# Altium schematic sheet 3_5V_Regulator.SchDoc
size A
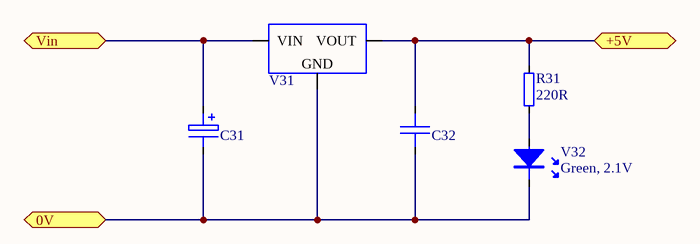
[diagram p0: 3_5V_Regulator.SchDoc]

## Parts
C31  CAP ELEC 100u 63V 20% Radial RoHS  [RBP-3.5-0.8-8.0]  (value not drawn)
C32  10u 50V  [1210]  (value not drawn)
R31  220R  [1206]
V31  LM78L05ACZ  [TO92_W]  (value not drawn)
V32  Green, 2.1V  [LED-0805]

## Ports
0V, +5V, Vin

## Nets
0V: C31.- C32.2 V31.y(GND) V32.k ; port 0V
+5V: C32.1 R31.1 V31.x(VOUT) ; port +5V
Vin: C31.+ V31.z(VIN) ; port Vin
NetR31_2: R31.2 V32.a

## Library data of the parts
C31 = 5900: Capacitor Polarised; Manufacturer: Panasonic; PartNumber: ECA1JM101; IPN: 5900; EndOfLife: Active EOL:Jul 2022; Characteristics: Ir=270mA tan=0.11 D=8 H=11.5 2000h; Lead_Process_Compatible: Yes; SubmittedBy: GXA; DeviceRank: 2; Part Field 1: CAP ELEC 100u 63V 20% Radial RoHS; Part Field 2: Panasonic ECA1JM101; ComponentLink1Description: Panasonic_ECA-1JM101_DS.pdf; ComponentLink2Description: Panasonic_ECA-1JM101_RCC.pdf; ComponentLink1URL: http://ecad.vsl.com.au/apps/BomGen/Data/rel/datasheets/new_parts/Panasonic_ECA-1JM101_DS.pdf; ComponentLink2URL: http://ecad.vsl.com.au/apps/BomGen/Data/rel/rohs_compliance/new_certificates/Panasonic_ECA-1JM101_RCC.pdf; Altium_Comment_Old: CAP ELEC 100u 63V 20% Radial RoHS; Altium_Comment: CAP ELEC 100u 63V 20% Radial RoHS; Symbol: CAP-POL; LastChanged: 9/11/12 09:27:10; Supplier1: Arrow; Supplier1_PartNumber: ECA1JM101; Supplier2: Digikey; Supplier2_PartNumber: P5193-ND; IPN_Search: 5900; OrderNumber: ECA1JM101; PartType: PCB; Price: US $0.1644; CheckedBy: VHQ; Price_100: M$0.123; Price_1000: M$0.104; Price_5000: M$0.093
C32 = 6024: Capacitor; Part Field 1: CAP CER 10u 10% 50V X7S 1210; Manufacturer: TDK; PartNumber: C3225X7S1H106K250AB; IPN: 6024; EndOfLife: Active EOL:Sep 2023; Characteristics: -55...125C; Lead_Process_Compatible: Yes; SubmittedBy: AFF; DeviceRank: 2; Part Field 2: TDK C3225X7S1H106K250AB; ComponentLink1Description: mlcc_commercial_general_en.pdf; ComponentLink2Description: TDK_C_Series_Capacitors_RoHS_CoC.pdf; ComponentLink1URL: http://ecad.vsl.com.au/apps/BomGen/Data/rel/datasheets/new_parts/mlcc_commercial_general_en.pdf; ComponentLink2URL: \\michelangelo\erg shared folder\ECAD\elecCAD\apps\BomGen\Data\rel\rohs_compliance\new_certificates\TDK_C_Series_Capacitors_RoHS_CoC.pdf; Altium_Comment_Old: CAP CER 10u 10% 50V X7S 1210; Altium_Comment: 10u 50V; Symbol: CAP; LastChanged: 26/02/14 13:10:58; Supplier1: Digikey; Supplier1_PartNumber: 445-4536-2-ND; IPN_Search: 6024; OrderNumber: C3225X7S1H106K250AB; PartType: PCB; Price: $0.31; CheckedBy: TTX; Price_100: M$0.495; Price_1000: M$0.339; Price_5000: M$0.292
R31 = 3827: Resistor; Part Field 1: RES 220R 1% 250mW 1206 RoHS; Manufacturer: Phycomp; PartNumber: RC1206FR-07220RL; IPN: 3827; EndOfLife: Active EOL:Jan 2023; Characteristics: 100ppm/C -55..+155C U=150Vrms Reel=5000pcs; OrderNumber: 232272462201L; Lead_Process_Compatible: Yes; SubmittedBy: ART; DeviceRank: 2; Part Field 2: Phycomp RC1206FR-07220RL; ComponentLink1Description: Phycomp_RC1206series_DS.pdf; ComponentLink2Description: Phycomp_Generic_RCS.pdf; ComponentLink1URL: http://ecad.vsl.com.au/apps/BomGen/Data/rel/datasheets/new_parts/Phycomp_RC1206series_DS.pdf; ComponentLink2URL: http://ecad.vsl.com.au/apps/BomGen/Data/rel/rohs_compliance/new_certificates/Phycomp_Generic_RCS.pdf; Altium_Comment_Old: RES 220R 1% 250mW 1206 RoHS; Altium_Comment: 220R; Symbol: RES; Supplier1: Arrow; Supplier1_PartNumber: RC1206FR-07220RL; Supplier2: Xon; IPN_Search: 3827; PartType: PCB; CheckedBy: ART; Price_5000: M$0.004
V31 = 7713: IC LM78LXX 3-terminal regulator TO92; Part Field 1: IC REG 78L05 +5V 100mA; Manufacturer: TI; PartNumber: LM78L05ACZ/NOPB; IPN: 7713; EndOfLife: Active EOL:Mar 2026; Characteristics: 0..+125C; Lead_Process_Compatible: Yes; SubmittedBy: vhq; DeviceRank: 2; Part Field 2: TI LM78L05ACZ/NOPB; ComponentLink1Description: TI_LM78L05ACZ_NOPB_TI_LM78Lxx.pdf; ComponentLink2Description: TI_LM78L05ACZ_NOPB_TI_LM78Lxx_RoHS.pdf; ComponentLink1URL: http://ecad.vsl.com.au/apps/BomGen/Data/rel/datasheets/TI/TI_LM78L05ACZ_NOPB_TI_LM78Lxx.pdf; ComponentLink2URL: http://ecad.vsl.com.au/apps/BomGen/Data/rel/rohs_compliance/new_certificates/TI_LM78L05ACZ_NOPB_TI_LM78Lxx_RoHS.pdf; Altium_Comment_Old: IC REG 78L05 +5V 100mA; Altium_Comment: LM78L05ACZ; Symbol: LM78LXX-TO92; LastChanged: 24/06/14 09:31:18; Supplier1: Digikey; Supplier1_PartNumber: LM78L05ACZNS/NOPB-ND; IPN_Search: 7713; OrderNumber: LM78L05ACZ/NOPB; PartType: PCB; CheckedBy: pfu
V32 = 6313: LED; Part Field 1: LED GREEN 0805 ROHS; Manufacturer: Chicago Miniature Lighting; PartNumber: CMD17-21UGC/TR8; IPN: 6313; EndOfLife: Active EOL:Sep 2021; Characteristics: GREEN Intensity=15mcd Ta=-40..+85C; Lead_Process_Compatible: Yes; SubmittedBy: ZJXL; DeviceRank: 2; Part Field 2: Chicago Miniature Lighting CMD17-21UGC/TR8; ComponentLink1Description: 1-25.pdf; ComponentLink2Description: CMD17-21UGC_TR8 RoHS CoC.pdf; ComponentLink1URL: \\michelangelo\erg shared folder\ECAD\elecCAD\apps\BomGen\Data\rel\datasheets\new_parts\1-25.pdf; ComponentLink2URL: \\michelangelo\erg shared folder\ECAD\elecCAD\apps\BomGen\Data\rel\rohs_compliance\new_certificates\CMD17-21UGC_TR8 RoHS CoC.pdf; Altium_Comment_Old: LED GREEN 0805 ROHS; Altium_Comment: LED Green; Symbol: LED; LastChanged: 6/09/13 17:30:23; Supplier1: Mouser; Supplier1_PartNumber: 606-CMD17-21UGC; Supplier2: DIGIKEY; Supplier2_PartNumber: L62415CT-ND; IPN_Search: 6313; OrderNumber: CMD17-21UGC/TR8; PartType: PCB; Price: 0.279 USD; CheckedBy: SAA; Price_100: M$0.170; Price_1000: M$0.150; Price_5000: M$0.150